# EAGLE design Orbiter_PowerSupply_V1 (EAGLE 9.5.2)
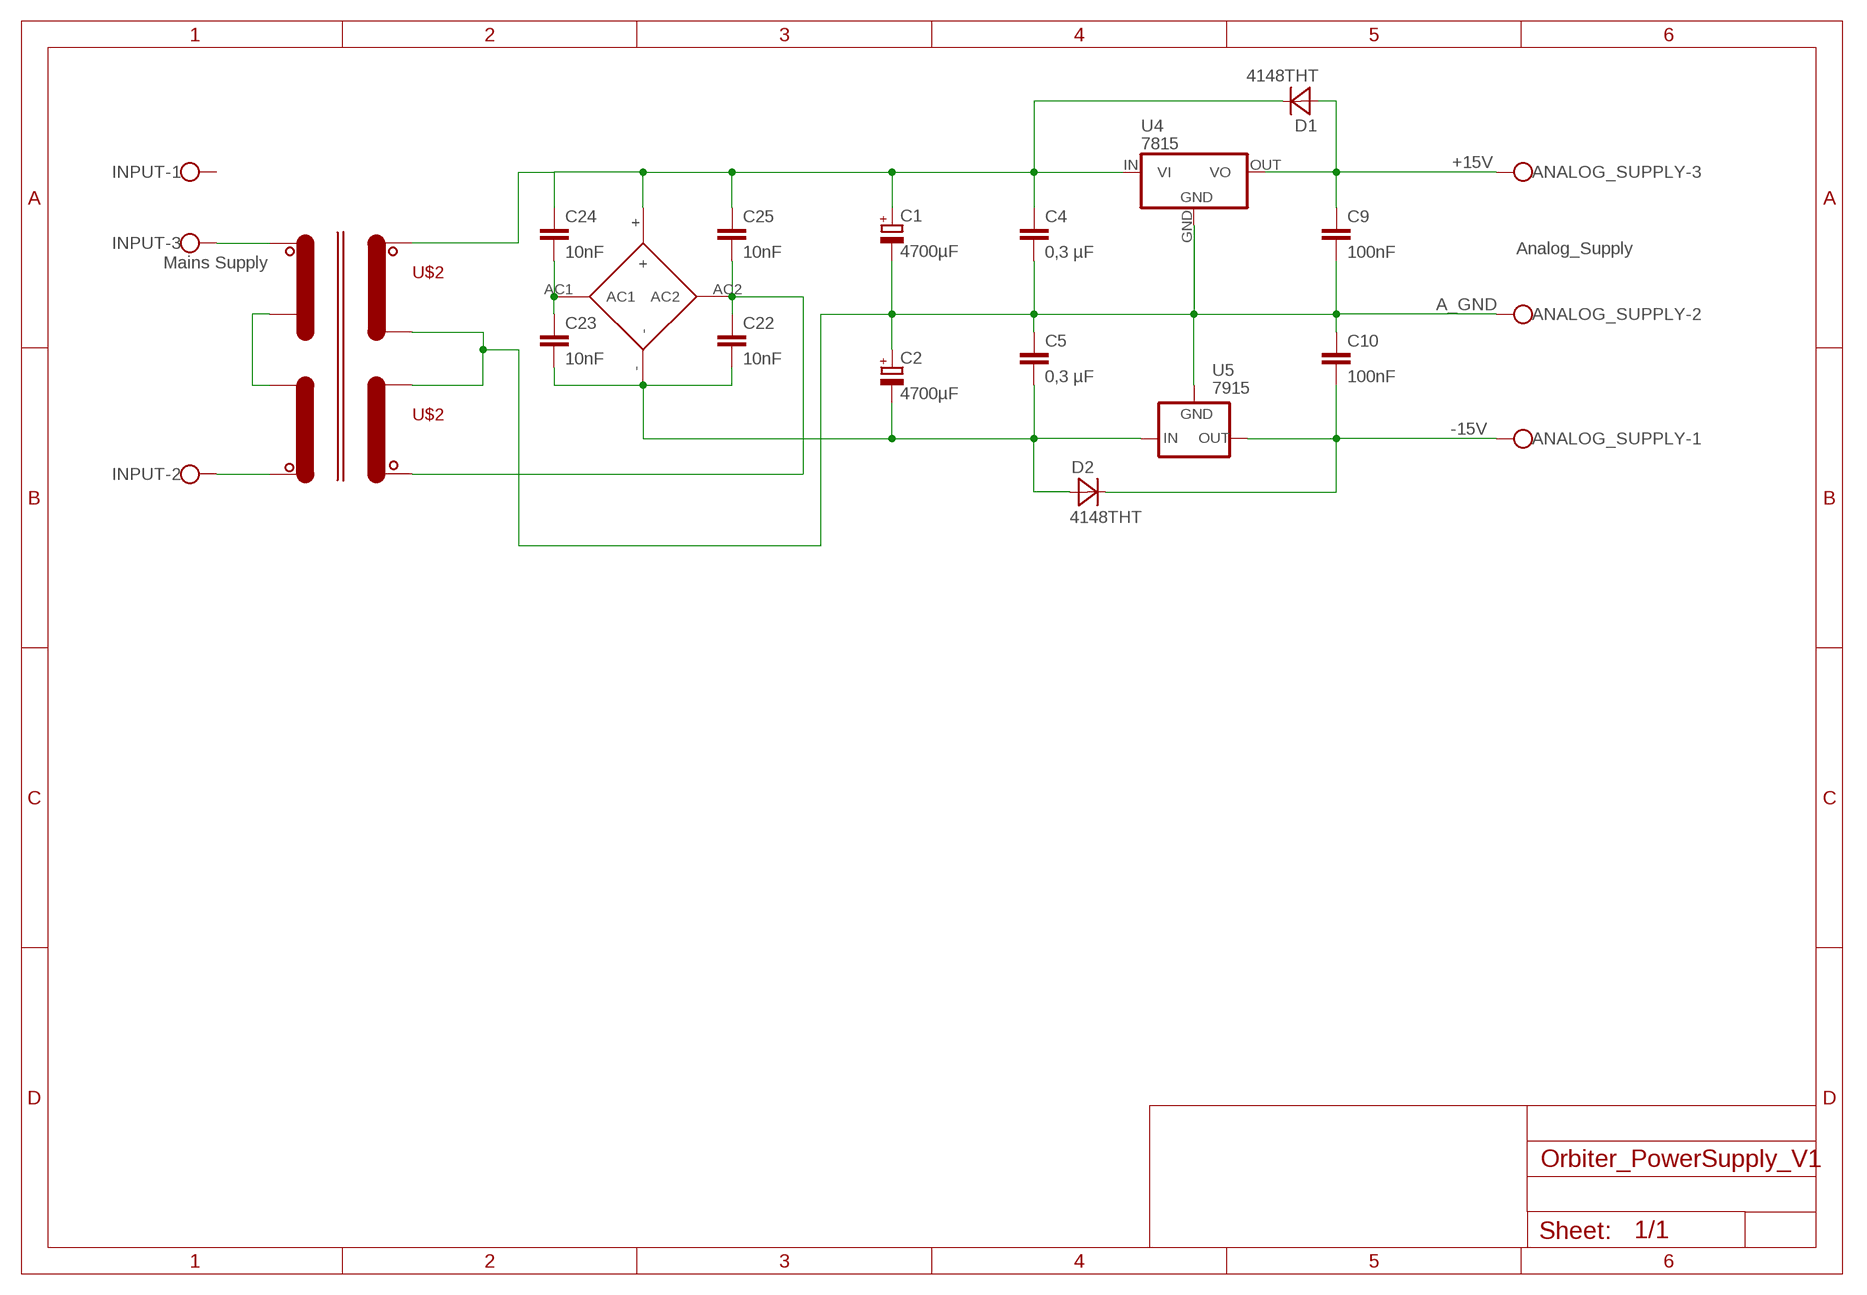
[diagram p0: schematic, sheet 1]

## Parts
ANALOG_SUPPLY  Analog_Supply  SCHRAUBKLEMME_3POL  [W237-103]
C1  4700µF  ELECTROLYTHIC_THT"  [ELECTROLYTIC_16MM]
C2  4700µF  ELECTROLYTHIC_THT"  [ELECTROLYTIC_16MM]
C4  0,3 µF  KONDENSATOR_THT5MM  [C5MM]
C5  0,3 µF  KONDENSATOR_THT5MM  [C5MM]
C9  100nF  KONDENSATOR_THT2.5MM  [C2.5MM]
C10  100nF  KONDENSATOR_THT2.5MM  [C2.5MM]
C22  10nF  KONDENSATOR_THT2.5MM  [C2.5MM]
C23  10nF  KONDENSATOR_THT2.5MM  [C2.5MM]
C24  10nF  KONDENSATOR_THT2.5MM  [C2.5MM]
C25  10nF  KONDENSATOR_THT2.5MM  [C2.5MM]
D1  4148THT  [D-5]
D2  4148THT  [D-5]
INPUT  Mains Supply  SCHRAUBKLEMME_3POL  [W237-103]
U4  7815  78THT  [78XXS_]
U5  7915  79  [79XXS]
U$1  GLEICHRICHTER  [SIL_RECTIFER]
U$2  PRINTTRAFO_30-600-LPI  [PRINTTRAFO_30-600-LPI]

## Nets
+15V: ANALOG_SUPPLY.3 C9.1 D1.A U4.OUT(VO)
-15V: ANALOG_SUPPLY.1 C10.2 D2.C U5.OUT
A_GND: ANALOG_SUPPLY.2 C1.- C2.+ C4.2 C5.1 C9.2 C10.1 U4.GND U5.GND U$2.6 U$2.8
N$1: INPUT.3 U$2.3
N$2: INPUT.2 U$2.1
N$3: C23.1 C24.2 U$1.AC1
N$4: C1.+ C4.1 C24.1 C25.1 D1.C U4.IN(VI) U$1.+ U$2.7
N$5: C22.1 C25.2 U$1.AC2 U$2.5
N$6: U$2.2 U$2.4
N$12: C2.- C5.2 C22.2 C23.2 D2.A U5.IN U$1.-
Unconnected: INPUT.1

## Library data of the parts
ANALOG_SUPPLY INPUT = C_Sager_Bibliothek:SCHRAUBKLEMME_3POL: WAGO SCREW CLAMP; MPN: 237-103; OC_FARNELL: unknown; OC_NEWARK: 18M7116
C1 C2 = C_Sager_Bibliothek:ELECTROLYTHIC_THT: DigiKey: P5159-ND(4700µF)
C4 C5 C9 C10 C22-C25 = C_Sager_Bibliothek:KONDENSATOR_THT
D1 D2 = C_Sager_Bibliothek:4148: Standard 4148 Diode SOD323 Format
U4 = C_Sager_Bibliothek:78**
U5 = C_Sager_Bibliothek:79**: VOLTAGE REGULATOR
U$1 = C_Sager_Bibliothek:GLEICHRICHTER: Reichelt: TS15P05G D2 TSC
U$2 = C_Sager_Bibliothek:PRINTTRAFO_30-600-LPI

## Board
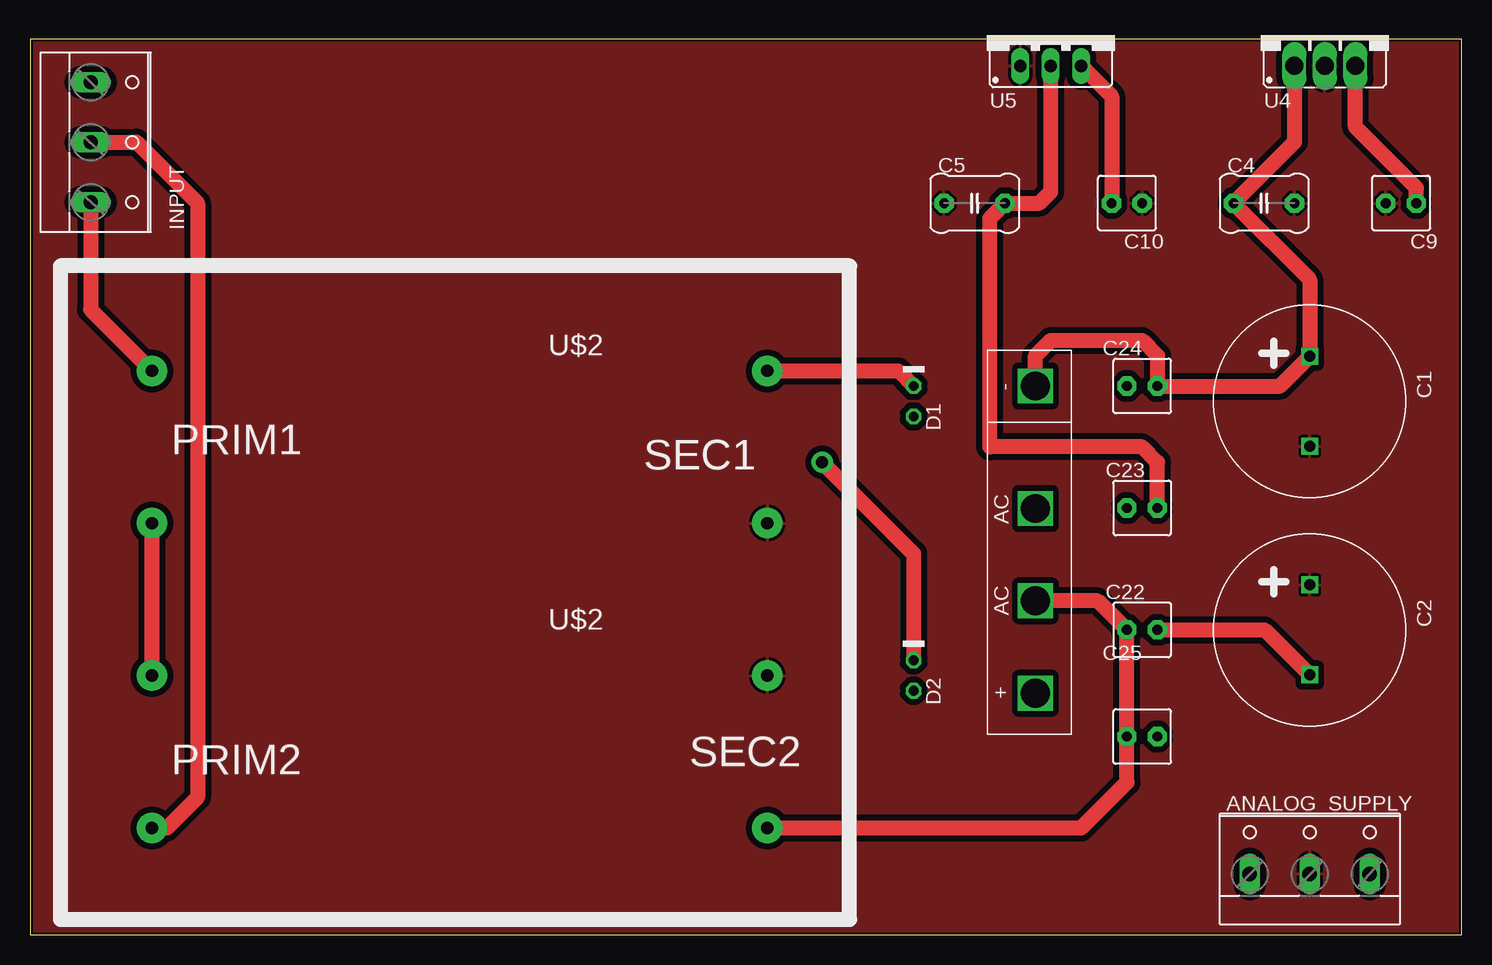
[diagram p1: board, top side]
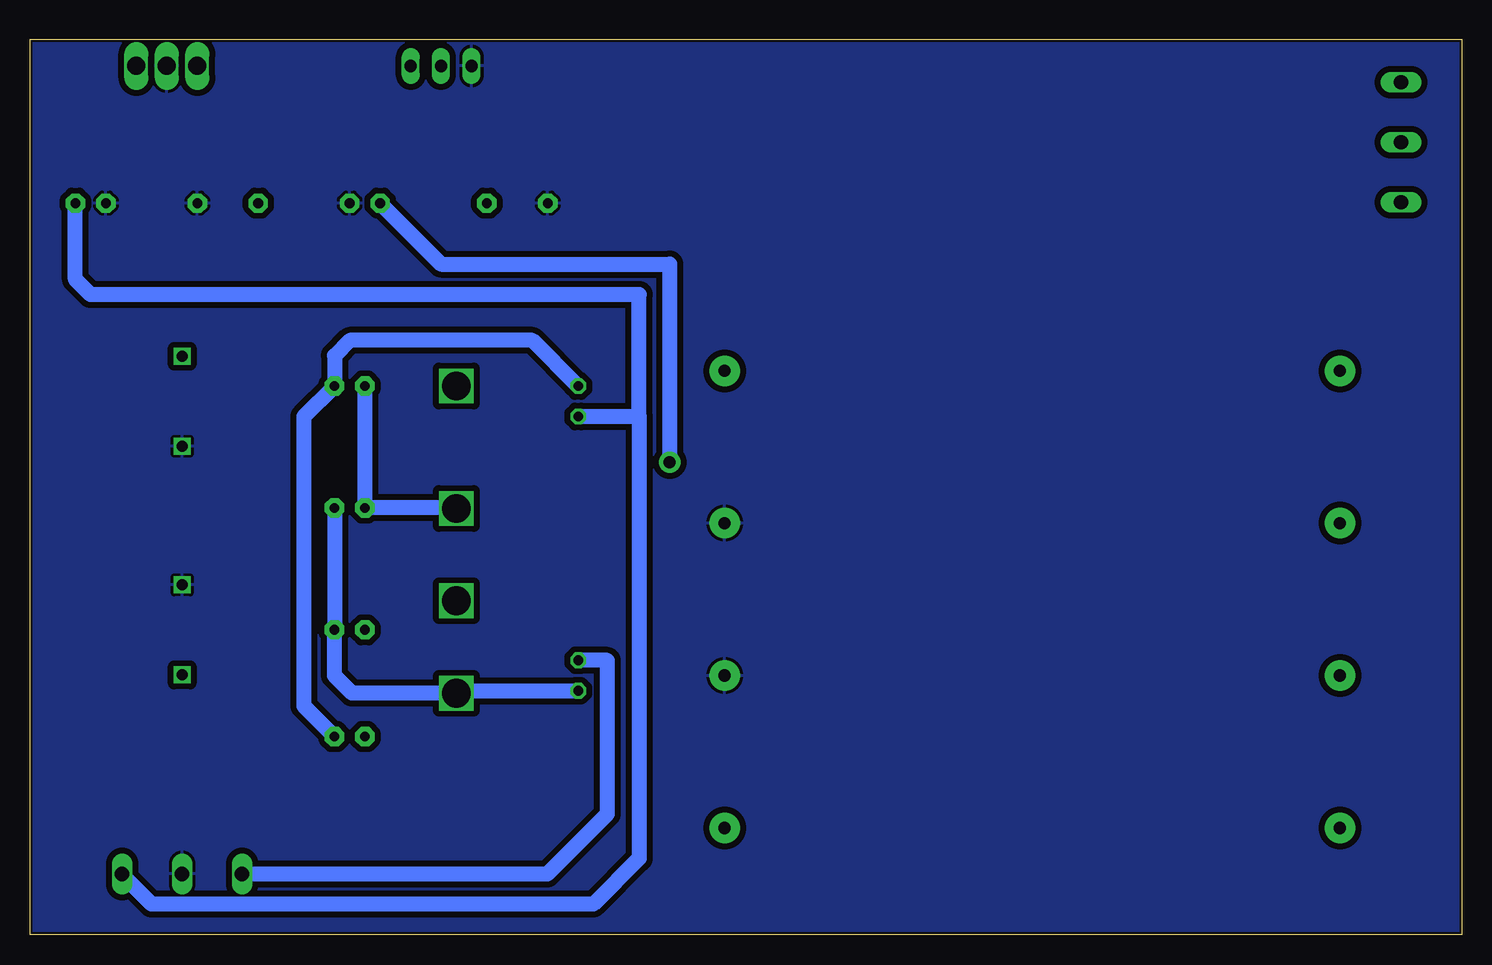
[diagram p2: board, bottom side, seen from below]

Size 119.36 x 74.6 mm. Coordinates in mm from the lower left corner, seen from the top.
Outline: 0,0 119.36,0 119.36,74.6 0,74.6 0,0
Copper layers (1*16): Top 0.035mm / dielectric 1.5mm / Bottom 0.035mm
Design rules "aisler_go_2layer *": minimum track width 0.1mm, minimum drill 0.2mm, track to track 0.5mm, track to pad 0.1mm, pad to pad 0.2mm, via to via 0.2mm, smd to smd 0.1mm, copper to edge 0.2mm, drill to drill 0.21mm, minimum pad ring 0.25mm, minimum via ring 0.05mm, stop-mask expansion 0.05mm, vias tented up to drill 100mil, thermal gap 10mil

### Footprints (pad centres in the part's own frame; a part is rotated, then mirrored left to right if it is on the bottom)
W237-103 = drill 1.194 long: 1 -5,-1.29; 2 0,-1.29; 3 5,-1.29
ELECTROLYTIC_16MM = drill 0.9 square: + -3.75,0; - 3.75,0
C5MM = drill 0.813 pad 1.6 octagon: 1 -1.27,0; 2 3.81,0
C2.5MM = drill 0.813 pad 1.6 octagon: 1 -1.27,0; 2 1.27,0
D-5 = drill 0.813 octagon: A 0,0; C -2.54,0
78XXS_ = drill 1.499 pad 1.93 long: GND 0,-2.54; IN -2.54,-2.54; OUT 2.54,-2.54
79XXS = drill 1.016 long: GND -2.54,-2.54; IN 0,-2.54; OUT 2.54,-2.54
SIL_RECTIFER = drill 2.4 square: + 0,0; - 25.6,0; AC1 10.2,0; AC2 17.9,0
PRINTTRAFO_30-600-LPI = drill 1.016 pad 2.54: 1 7.62,7.62; 2 7.62,20.32; 3 7.62,45.72; 4 7.62,33.02; 5 58.92,7.62; 6 58.92,20.32; 7 58.92,45.72; 8 58.92,33.02

### Placement (x,y rotation side)
ANALOG_SUPPLY  106.68,6.35 0 top
C1  106.68,44.45 270 top
C2  106.68,25.4 270 top
C4  101.6,60.96 0 top
C5  77.47,60.96 0 top
C9  114.3,60.96 180 top
C10  91.44,60.96 180 top
C22  92.71,25.4 0 top
C23  92.71,35.56 0 top
C24  92.71,45.72 180 top
C25  92.71,16.51 180 top
D1  73.66,43.18 270 top
D2  73.66,20.32 270 top
INPUT  6.35,66.04 270 top
U4  107.95,74.93 0 top
U5  85.09,74.93 0 top
U$1  83.82,45.72 270 top
U$2  2.54,1.27 0 top

### Tracks (layer width: path | path; a pad name or v marks a point on that pad's centre or on a via)
+15V
  Top 1.27: C9.1 115.57,62.23 110.49,67.31 U4.OUT
  Bottom 1.27: D1.A 68.58,43.18 | ANALOG_SUPPLY.3 111.7,5.08 111.76,5.08 109.22,2.54 72.39,2.54 68.58,6.35 68.58,43.18 | 68.58,43.18 68.58,53.34 114.3,53.34 115.57,54.61 C9.1
-15V  (via drill 1 pad 1.78)
  Top 1.27: U5.OUT 90.17,69.85 C10.2 | v66.04,39.37 73.66,31.75 D2.C
  Bottom 1.27: ANALOG_SUPPLY.1 76.22,5.06 71.22,10.06 71.22,22.86 D2.C | C10.2 85.09,55.88 66.04,55.88 v66.04,39.37
A_GND
  pour Top: -1.27,74.93 -1.27,-1.27 120.65,-1.27 120.65,74.93
  pour Bottom: -2.54,76.2 -2.54,-2.54 121.92,-2.54 121.92,76.2
N$1
  Top 1.27: INPUT.3 5.06,52.09 U$2.3
N$2
  Top 1.27: INPUT.2 8.89,66.04 13.97,60.96 13.97,11.43 11.43,8.89 U$2.1
N$3
  Bottom 1.27: U$1.AC1 83.86,35.56 C23.1 C24.2
N$4
  Top 1.27: U$2.7 72.39,46.99 D1.C | U$1.+ 83.82,48.26 85.09,49.53 92.71,49.53 93.98,48.26 C24.1 104.2,45.72 C1.+ 106.68,54.61 C4.1 105.41,66.04 U4.IN
  Bottom 1.27: C25.1 96.52,19.05 96.52,43.18 C24.1 93.98,48.26 92.71,49.53 77.47,49.53 D1.C
N$5
  Top 1.27: U$2.5 87.63,8.89 91.44,12.7 C25.2 C22.1 89.02,27.82 U$1.AC2
N$6
  Top 1.27: U$2.4 U$2.2
N$12
  Top 1.27: C22.2 102.93,25.4 C2.- | C23.2 93.98,39.37 92.71,40.64 80.01,40.64 80.01,59.69 C5.2 84.15,60.96 85.09,61.9 U5.IN
  Bottom 1.27: C23.2 C22.2 93.98,21.59 92.51,20.12 U$1.- 83.62,20.32 D2.A